# EAGLE schematic sensor (EAGLE 8.3.2)
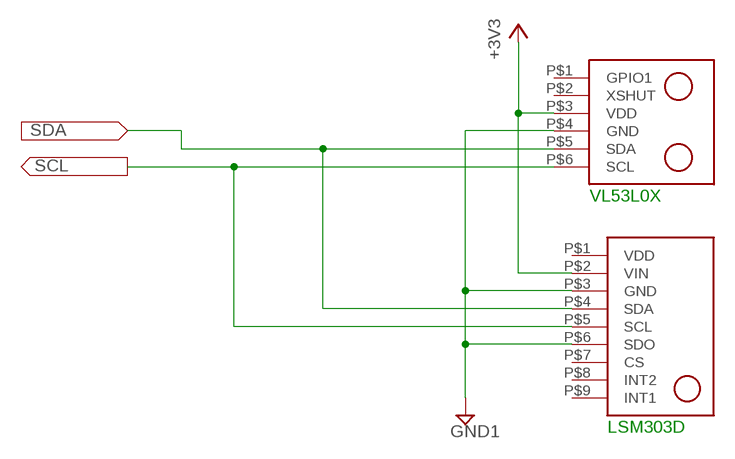
[diagram p0: schematic, sheet 1]

## Parts
U$1  VL53L0X  [VL53L0X]
U$2  LSM303D  [LSM303D]

## Nets
+3V3: U$1.P$3(VDD) U$2.P$2(VIN)
GND1: U$1.P$4(GND) U$2.P$3(GND) U$2.P$6(SDO)
N$1: U$1.P$6(SCL) U$2.P$5(SCL)
N$2: U$1.P$5(SDA) U$2.P$4(SDA)
Unconnected: U$1.P$1(GPIO1) U$1.P$2(XSHUT) U$2.P$1(VDD) U$2.P$7(CS) U$2.P$8(INT2) U$2.P$9(INT1)

## Notes on the sheet
- VL53L0X
- LSM303D

## Library data of the parts
U$1 = getter-sensor:VL53L0X
U$2 = getter-sensor:LSM303D